# Altium schematic sheet 18_ETH.SchDoc (part 1 of 2)
size A2; SheetNumber: 19; SheetTotal: 24
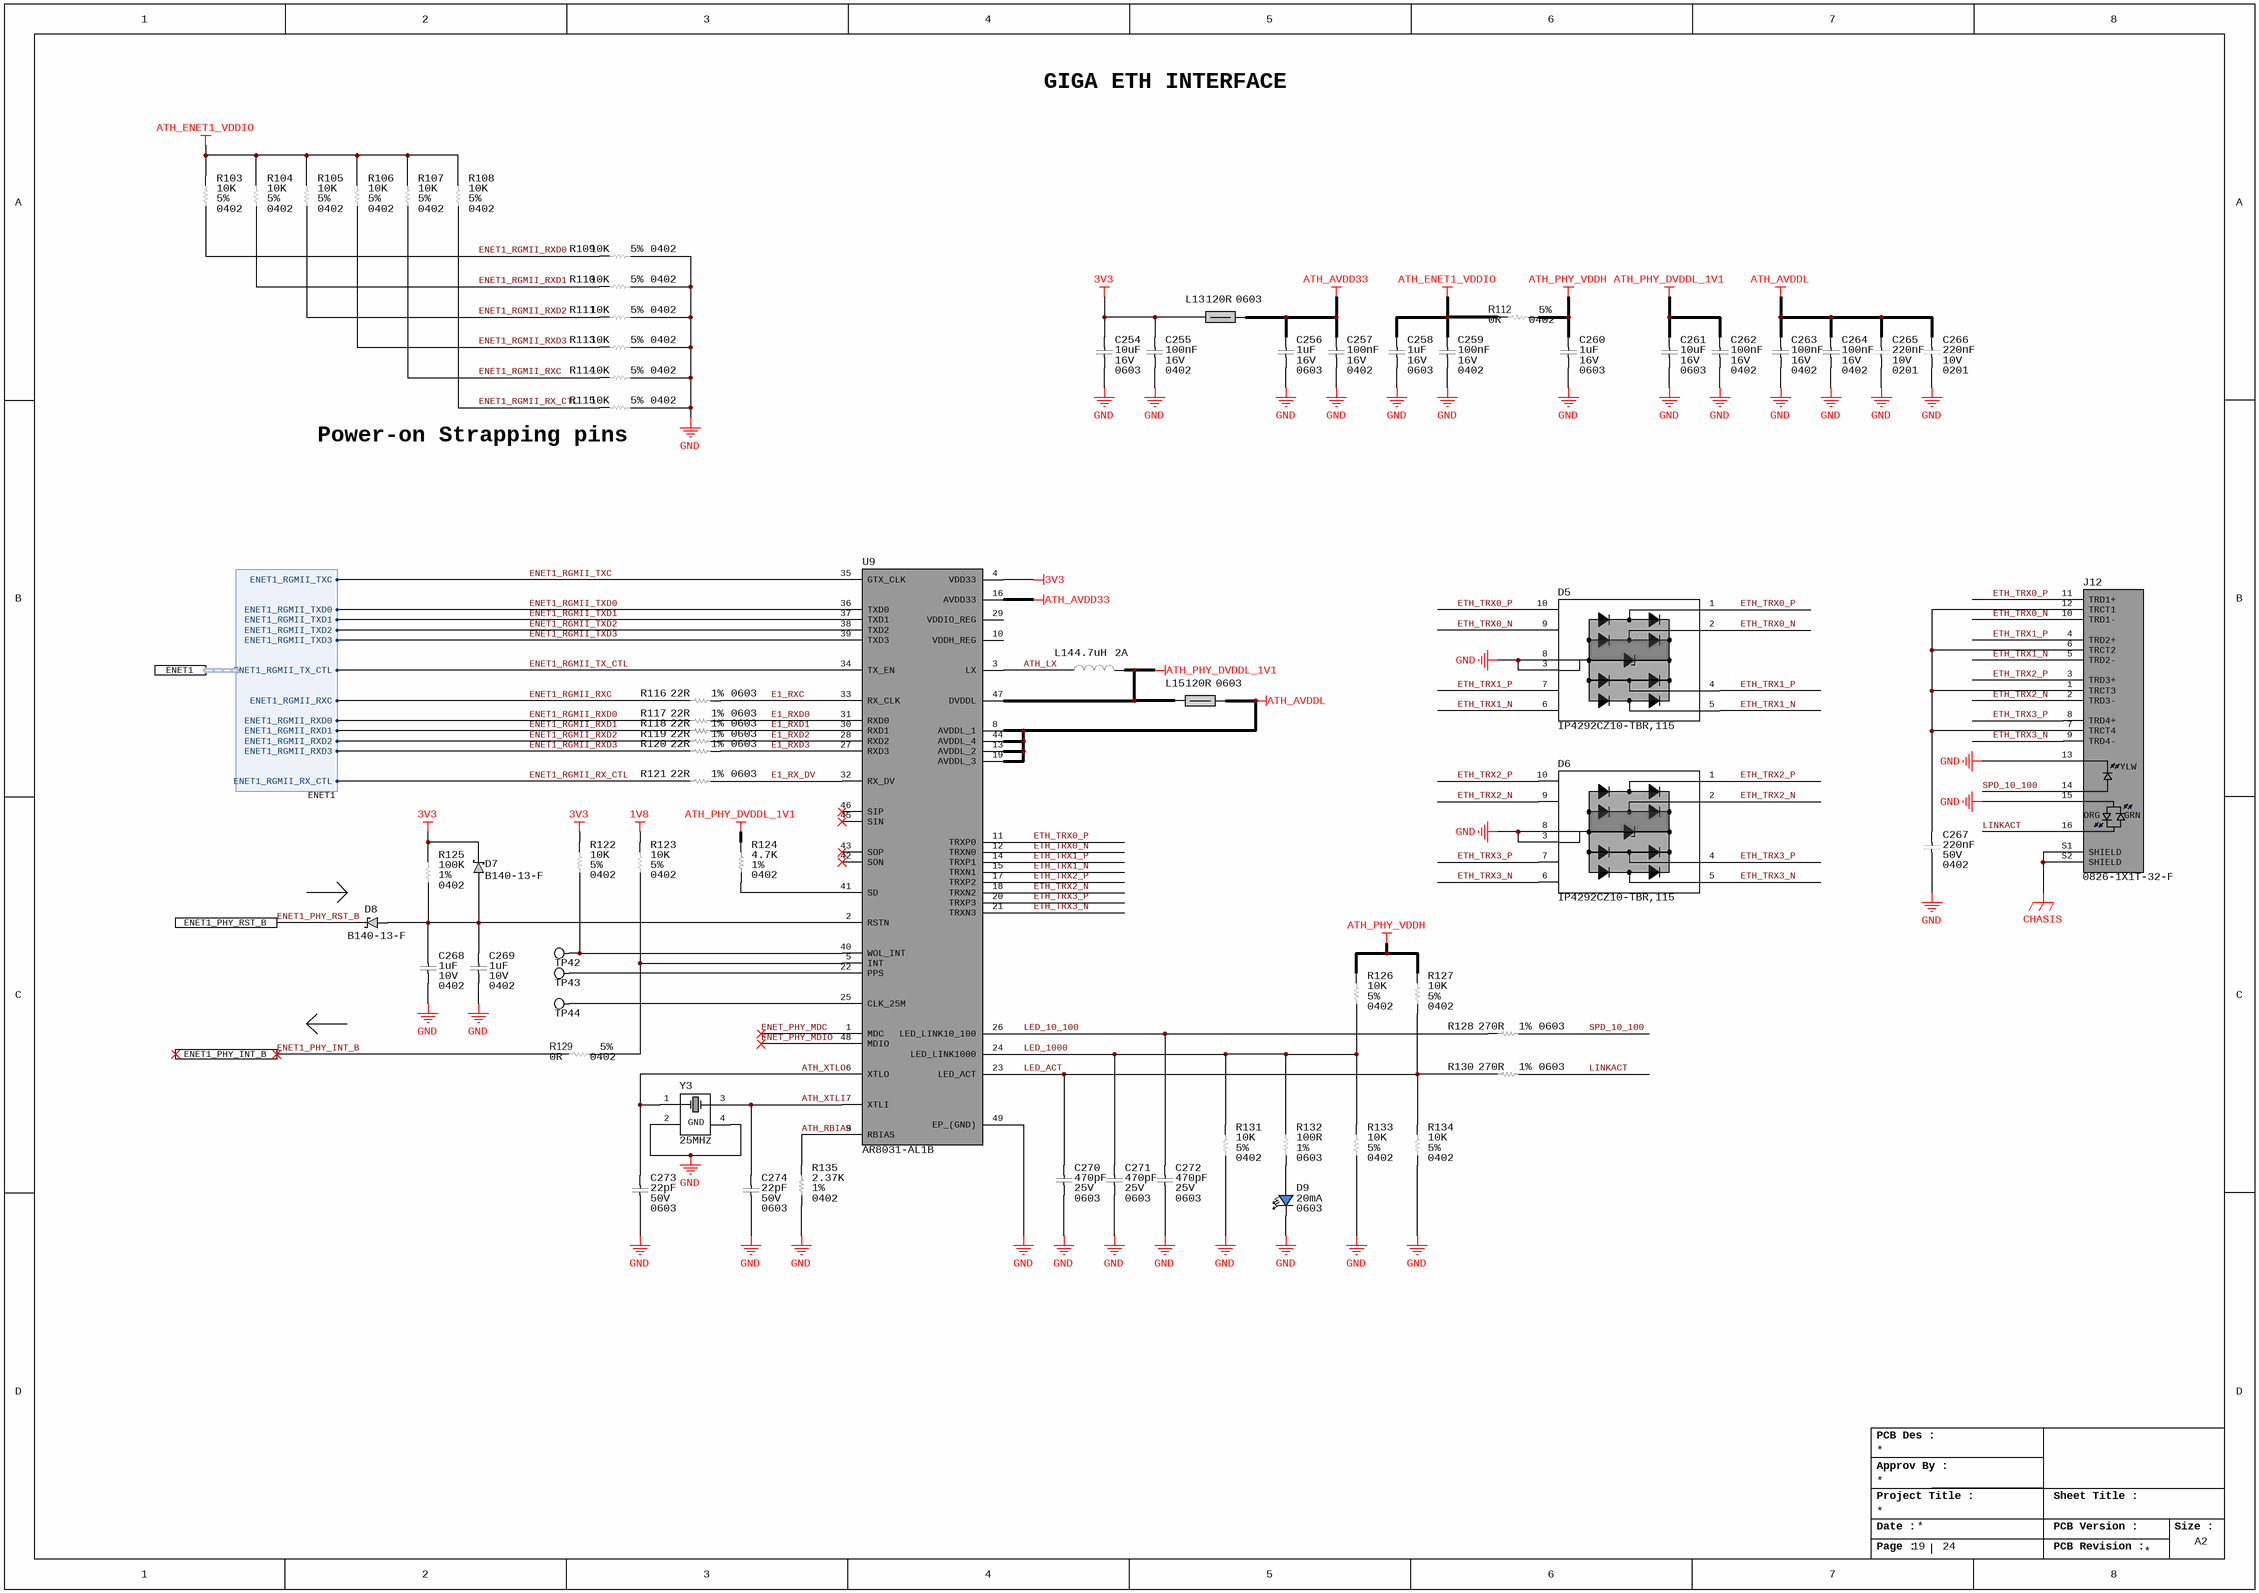
[diagram p0: 18_ETH.SchDoc]

## Parts
C254  Voltage Rating: 16V  Capacitance: 10uF  Case/Package: 0603  [CAP_0603_CAPC1608X08N]  (hidden comment: GRM188R61C106MAALD)
C255  Voltage Rating: 16V  Capacitance: 100nF  Case/Package: 0402  [CAP_0402_CAPC1005X05N]  (hidden comment: CL05B104KO5NNNC)
C256  Voltage Rating: 16V  Capacitance: 1uF  Case/Package: 0603  [CAP_0603_CAPC1608X08N]  (hidden comment: CL10A105KO8NNNC)
C257  Voltage Rating: 16V  Capacitance: 100nF  Case/Package: 0402  [CAP_0402_CAPC1005X05N]  (hidden comment: CL05B104KO5NNNC)
C258  Voltage Rating: 16V  Capacitance: 1uF  Case/Package: 0603  [CAP_0603_CAPC1608X08N]  (hidden comment: CL10A105KO8NNNC)
C259  Voltage Rating: 16V  Capacitance: 100nF  Case/Package: 0402  [CAP_0402_CAPC1005X05N]  (hidden comment: CL05B104KO5NNNC)
C260  Voltage Rating: 16V  Capacitance: 1uF  Case/Package: 0603  [CAP_0603_CAPC1608X08N]  (hidden comment: CL10A105KO8NNNC)
C261  Voltage Rating: 16V  Capacitance: 10uF  Case/Package: 0603  [CAP_0603_CAPC1608X08N]  (hidden comment: GRM188R61C106MAALD)
C262  Voltage Rating: 16V  Capacitance: 100nF  Case/Package: 0402  [CAP_0402_CAPC1005X05N]  (hidden comment: CL05B104KO5NNNC)
C263  Voltage Rating: 16V  Capacitance: 100nF  Case/Package: 0402  [CAP_0402_CAPC1005X05N]  (hidden comment: CL05B104KO5NNNC)
C264  Voltage Rating: 16V  Capacitance: 100nF  Case/Package: 0402  [CAP_0402_CAPC1005X05N]  (hidden comment: CL05B104KO5NNNC)
C265  Voltage Rating (DC): 10V  Capacitance: 220nF  Case/Package: 0201  [CAP_0201_CAPC0603X03N]  (hidden comment: LMK063BJ224MP-F)
C266  Voltage Rating (DC): 10V  Capacitance: 220nF  Case/Package: 0201  [CAP_0201_CAPC0603X03N]  (hidden comment: LMK063BJ224MP-F)
C267  Case/Package: 0402  Voltage Rating (DC): 50V  Capacitance: 220nF  [CAP_0402_CAPC1005X05N]  (hidden comment: GRM155R61H224KE01W)
C268  Voltage Rating: 10V  Capacitance: 1uF  Case/Package: 0402  [CAP_0402_CAPC1005X05N]  (hidden comment: GRM155C81A105KA12D)
C269  Voltage Rating: 10V  Capacitance: 1uF  Case/Package: 0402  [CAP_0402_CAPC1005X05N]  (hidden comment: GRM155C81A105KA12D)
C270  Voltage Rating: 25V  Capacitance: 470pF  Case Code (Imperial): 0603  [CAP_0603_CAPC1608X08N]  (hidden comment: C0603C471K3RACTU)
C271  Voltage Rating: 25V  Capacitance: 470pF  Case Code (Imperial): 0603  [CAP_0603_CAPC1608X08N]  (hidden comment: C0603C471K3RACTU)
C272  Voltage Rating: 25V  Capacitance: 470pF  Case Code (Imperial): 0603  [CAP_0603_CAPC1608X08N]  (hidden comment: C0603C471K3RACTU)
C273  Voltage Rating (DC): 50V  Capacitance: 22pF  Case/Package: 0603  [CAP_0603_CAPC1608X08N]  (hidden comment: C0603C220J5GACTU)
C274  Voltage Rating (DC): 50V  Capacitance: 22pF  Case/Package: 0603  [CAP_0603_CAPC1608X08N]  (hidden comment: C0603C220J5GACTU)
D5  IP4292CZ10-TBR,115  [DIO_TVS_SON50P100X250X50-10N]
D6  IP4292CZ10-TBR,115  [DIO_TVS_SON50P100X250X50-10N]
D7  B140-13-F  [DIOM5226X240N]
D8  B140-13-F  [DIOM5226X240N]
D9  Case/Packcage: 0603  Test Current: 20mA  [LED_0603-BLUE-0.75mm]  (hidden comment: ASCKCB00-NS3T4010302)
J12  0826-1X1T-32-F  [BEL_0826-1X1T-32-F]
L13  Impedance: 120R  Case/Package: 0603  [IND_0603_INDC1608X08N]  (hidden comment: BLM18PG121SH1D)
L14  Current Rating: 2A  Inductance: 4.7uH  [DFE2HCAH1R0MJ0L]  (hidden comment: DFE252012P-4R7M=P2)
L15  Impedance: 120R  Case/Package: 0603  [IND_0603_INDC1608X08N]  (hidden comment: BLM18PG121SH1D)
R103  Tolerance: 5%  Resistance: 10K  Case/Package: 0402  [RES_0402_RESC1005X04N]  (hidden comment: ERJ-2GEJ103X)
R104  Tolerance: 5%  Resistance: 10K  Case/Package: 0402  [RES_0402_RESC1005X04N]  (hidden comment: ERJ-2GEJ103X)
R105  Tolerance: 5%  Resistance: 10K  Case/Package: 0402  [RES_0402_RESC1005X04N]  (hidden comment: ERJ-2GEJ103X)
R106  Tolerance: 5%  Resistance: 10K  Case/Package: 0402  [RES_0402_RESC1005X04N]  (hidden comment: ERJ-2GEJ103X)
R107  Tolerance: 5%  Resistance: 10K  Case/Package: 0402  [RES_0402_RESC1005X04N]  (hidden comment: ERJ-2GEJ103X)
R108  Tolerance: 5%  Resistance: 10K  Case/Package: 0402  [RES_0402_RESC1005X04N]  (hidden comment: ERJ-2GEJ103X)
R109  Tolerance: 5%  Resistance: 10K  Case/Package: 0402  [RES_0402_RESC1005X04N]  (hidden comment: ERJ-2GEJ103X)
R110  Tolerance: 5%  Resistance: 10K  Case/Package: 0402  [RES_0402_RESC1005X04N]  (hidden comment: ERJ-2GEJ103X)
R111  Tolerance: 5%  Resistance: 10K  Case/Package: 0402  [RES_0402_RESC1005X04N]  (hidden comment: ERJ-2GEJ103X)
R112  Case Code (Imperial): 0402  Tolerance: 5%  Resistance: 0R  [RES_0402_RESC1005X04N]  (hidden comment: ERJ-2GE0R00X)
R113  Tolerance: 5%  Resistance: 10K  Case/Package: 0402  [RES_0402_RESC1005X04N]  (hidden comment: ERJ-2GEJ103X)
R114  Tolerance: 5%  Resistance: 10K  Case/Package: 0402  [RES_0402_RESC1005X04N]  (hidden comment: ERJ-2GEJ103X)
R115  Tolerance: 5%  Resistance: 10K  Case/Package: 0402  [RES_0402_RESC1005X04N]  (hidden comment: ERJ-2GEJ103X)
R116  Tolerance: 1%  Resistance: 22R  Case/Package: 0603  [RES_0603_RESC1608X04N]  (hidden comment: RC0603FR-0722RL)
R117  Tolerance: 1%  Resistance: 22R  Case/Package: 0603  [RES_0603_RESC1608X04N]  (hidden comment: RC0603FR-0722RL)
R118  Tolerance: 1%  Resistance: 22R  Case/Package: 0603  [RES_0603_RESC1608X04N]  (hidden comment: RC0603FR-0722RL)
R119  Tolerance: 1%  Resistance: 22R  Case/Package: 0603  [RES_0603_RESC1608X04N]  (hidden comment: RC0603FR-0722RL)
R120  Tolerance: 1%  Resistance: 22R  Case/Package: 0603  [RES_0603_RESC1608X04N]  (hidden comment: RC0603FR-0722RL)
R121  Tolerance: 1%  Resistance: 22R  Case/Package: 0603  [RES_0603_RESC1608X04N]  (hidden comment: RC0603FR-0722RL)
R122  Tolerance: 5%  Resistance: 10K  Case/Package: 0402  [RES_0402_RESC1005X04N]  (hidden comment: ERJ-2GEJ103X)
R123  Tolerance: 5%  Resistance: 10K  Case/Package: 0402  [RES_0402_RESC1005X04N]  (hidden comment: ERJ-2GEJ103X)
R124  Tolerance: 1%  Case Code (Imperial): 0402  Resistance: 4.7K  [RES_0402_RESC1005X04N]  (hidden comment: ERJ-2RKF4701X)
R125  Resistance: 100K  Tolerance: 1%  Case/Package: 0402  [RES_0402_RESC1005X04N]  (hidden comment: RC0402FR-07100KL)
R126  Tolerance: 5%  Resistance: 10K  Case/Package: 0402  [RES_0402_RESC1005X04N]  (hidden comment: ERJ-2GEJ103X)
R127  Tolerance: 5%  Resistance: 10K  Case/Package: 0402  [RES_0402_RESC1005X04N]  (hidden comment: ERJ-2GEJ103X)
R128  Tolerance: 1%  Resistance: 270R  Case/Package: 0603  [RES_0603_RESC1608X04N]  (hidden comment: RC0603FR-07270RL)
R129  Case Code (Imperial): 0402  Tolerance: 5%  Resistance: 0R  [RES_0402_RESC1005X04N]  (hidden comment: ERJ-2GE0R00X)
R130  Tolerance: 1%  Resistance: 270R  Case/Package: 0603  [RES_0603_RESC1608X04N]  (hidden comment: RC0603FR-07270RL)
R131  Tolerance: 5%  Resistance: 10K  Case/Package: 0402  [RES_0402_RESC1005X04N]  (hidden comment: ERJ-2GEJ103X)
R132  Case Code (Imperial): 0603  Tolerance: 1%  Resistance: 100R  [CAP_0603_CAPC1608X08N]  (hidden comment: ERJ3EKF1000V)
R133  Tolerance: 5%  Resistance: 10K  Case/Package: 0402  [RES_0402_RESC1005X04N]  (hidden comment: ERJ-2GEJ103X)
R134  Tolerance: 5%  Resistance: 10K  Case/Package: 0402  [RES_0402_RESC1005X04N]  (hidden comment: ERJ-2GEJ103X)
R135  Tolerance: 1%  Resistance: 2.37K  Case/Package: 0402  [RES_0402_RESC1005X04N]  (hidden comment: ERJ-2RKF2371X)
TP42  NO COMPONENT  [TP_PAD_0.5MM_SMD_ROUND]  (value not drawn)  (no BOM)
TP43  NO COMPONENT  [TP_PAD_0.5MM_SMD_ROUND]  (value not drawn)  (no BOM)
TP44  NO COMPONENT  [TP_PAD_0.5MM_SMD_ROUND]  (value not drawn)  (no BOM)
U9  AR8031-AL1B  [QFN40P600X600X80-49N]
Y3  Frequency: 25MHz  [405C35B25M00000]  (hidden comment: 405C35B25M00000)

## Ports
ENET1 (harness ENET1), ENET1_PHY_INT_B, ENET1_PHY_RST_B

## Harnesses
ENET1: ENET1_RGMII_TXC, ENET1_RGMII_TX_CTL, ENET1_RGMII_TXD0, ENET1_RGMII_TXD1, ENET1_RGMII_TXD2, ENET1_RGMII_TXD3, ENET1_RGMII_RXC, ENET1_RGMII_RX_CTL, ENET1_RGMII_RXD0, ENET1_RGMII_RXD1, ENET1_RGMII_RXD2, ENET1_RGMII_RXD3

## Nets
1V8: R123.2
3V3: C254.2 C255.2 D7.1(K) L13.1 R122.2 R125.2 U9.4(VDD33)
ATH_AVDD33: C256.2 C257.2 L13.2 U9.16(AVDD33)
ATH_AVDDL: C263.2 C264.2 C265.2 C266.2 L15.2 U9.8(AVDDL_1) U9.13(AVDDL_2) U9.19(AVDDL_3) U9.44(AVDDL_4)
ATH_ENET1_VDDIO: C258.2 C259.2 R103.2 R104.2 R105.2 R106.2 R107.2 R108.2 R112.1
ATH_PHY_DVDDL_1V1: C261.2 C262.2 L14.2 L15.1 R124.2 U9.47(DVDDL)
ATH_PHY_VDDH: C260.2 R112.2 R126.2 R127.2
CHASIS: J12.S1(SHIELD) J12.S2(SHIELD)
GND: C254.1 C255.1 C256.1 C257.1 C258.1 C259.1 C260.1 C261.1 C262.1 C263.1 C264.1 C265.1 C266.1 C267.1 C268.1 C269.1 C270.1 C271.1 C272.1 C273.1 C274.1 D5.3(GND1) D5.8(GND2) D6.3(GND1) D6.8(GND2) D9.1(C) J12.13 J12.15 R109.1 R110.1 R111.1 R113.1 R114.1 R115.1 R131.1 R133.1 R134.1 R135.1 U9.49(EP_(GND)) Y3.2(GND_1) Y3.4(GND_2)
ATH_LX: L14.1 U9.3(LX)
ATH_RBIAS: R135.2 U9.9(RBIAS)
ATH_XTLI: C274.2 U9.7(XTLI) Y3.3(XTAL_2)
ATH_XTLO: C273.2 U9.6(XTLO) Y3.1(XTAL_1)
E1_RX_DV: R121.2 U9.32(RX_DV)
E1_RXC: R116.2 U9.33(RX_CLK)
E1_RXD0: R117.2 U9.31(RXD0)
E1_RXD1: R118.2 U9.30(RXD1)
E1_RXD2: R119.2 U9.28(RXD2)
E1_RXD3: R120.2 U9.27(RXD3)
ENET1_PHY_INT_B: R129.1 ; port ENET1_PHY_INT_B
ENET1_PHY_RST_B: D8.1(K) ; port ENET1_PHY_RST_B
ENET1_RGMII_RX_CTL: R108.1 R115.2 R121.1 ; port ENET1.ENET1_RGMII_RX_CTL
ENET1_RGMII_RXC: R107.1 R114.2 R116.1 ; port ENET1.ENET1_RGMII_RXC
ENET1_RGMII_RXD0: R103.1 R109.2 R117.1 ; port ENET1.ENET1_RGMII_RXD0
ENET1_RGMII_RXD1: R104.1 R110.2 R118.1 ; port ENET1.ENET1_RGMII_RXD1
ENET1_RGMII_RXD2: R105.1 R111.2 R119.1 ; port ENET1.ENET1_RGMII_RXD2
ENET1_RGMII_RXD3: R106.1 R113.2 R120.1 ; port ENET1.ENET1_RGMII_RXD3
ENET1_RGMII_TX_CTL: U9.34(TX_EN) ; port ENET1.ENET1_RGMII_TX_CTL
ENET1_RGMII_TXC: U9.35(GTX_CLK) ; port ENET1.ENET1_RGMII_TXC
ENET1_RGMII_TXD0: U9.36(TXD0) ; port ENET1.ENET1_RGMII_TXD0
ENET1_RGMII_TXD1: U9.37(TXD1) ; port ENET1.ENET1_RGMII_TXD1
ENET1_RGMII_TXD2: U9.38(TXD2) ; port ENET1.ENET1_RGMII_TXD2
ENET1_RGMII_TXD3: U9.39(TXD3) ; port ENET1.ENET1_RGMII_TXD3
ENET_PHY_MDC: U9.1(MDC)
ENET_PHY_MDIO: U9.48(MDIO)
ETH_TRX0_N: D5.2(CH2) D5.9(NC3) J12.10(TRD1-) U9.12(TRXN0)
ETH_TRX0_P: D5.1(CH1) D5.10(NC4) J12.11(TRD1+) U9.11(TRXP0)
ETH_TRX1_N: D5.5(CH4) D5.6(NC1) J12.5(TRD2-) U9.15(TRXN1)
ETH_TRX1_P: D5.4(CH3) D5.7(NC2) J12.4(TRD2+) U9.14(TRXP1)
ETH_TRX2_N: D6.2(CH2) D6.9(NC3) J12.2(TRD3-) U9.18(TRXN2)
ETH_TRX2_P: D6.1(CH1) D6.10(NC4) J12.3(TRD3+) U9.17(TRXP2)
ETH_TRX3_N: D6.5(CH4) D6.6(NC1) J12.9(TRD4-) U9.21(TRXN3)
ETH_TRX3_P: D6.4(CH3) D6.7(NC2) J12.8(TRD4+) U9.20(TRXP3)
LED_10_100: C272.2 R128.1 U9.26(LED_LINK10_100)
LED_1000: C271.2 R126.1 R131.2 R132.1 R133.2 U9.24(LED_LINK1000)
LED_ACT: C270.2 R127.1 R130.1 R134.2 U9.23(LED_ACT)
LINKACT: J12.16 R130.2
SPD_10_100: J12.14 R128.2
NetC267_2: C267.2 J12.1(TRCT3) J12.6(TRCT2) J12.7(TRCT4) J12.12(TRCT1)
NetC268_2: C268.2 C269.2 D7.2(A) D8.2(A) R125.1 U9.2(RSTN)
NetD9_2: D9.2(A) R132.2
NetR122_1: R122.1 TP42.1 U9.40(WOL_INT)
NetR123_1: R123.1 R129.2 U9.5(INT)
NetR124_1: R124.1 U9.41(SD)
NetTP43_1: TP43.1 U9.22(PPS)
NetTP44_1: TP44.1 U9.25(CLK_25M)

Not connected (* = marked no-connect by the designer): U9 10(VDDH_REG) 29(VDDIO_REG) 42(SON)* 43(SOP)* 45(SIN)* 46(SIP)*

## Notes on the sheet
- GIGA ETH INTERFACE
- Power-on Strapping pins
- PCB Des :
- Approv By :
- Project Title :
- Sheet Title :
- Date :
- Page :
- PCB Version :
- PCB Revision :
- Size :
- A2
- (in symbol CONN_RJ45_0826-1X1T-32-F) YLW; ORG; GRN
- (in symbol CRYSTAL_25MHZ_13PF_405C35B25M00000) GND